# Altium project Cats_and_Dogs_Schematics_ESE516.PrjPcb (part 1 of 3)
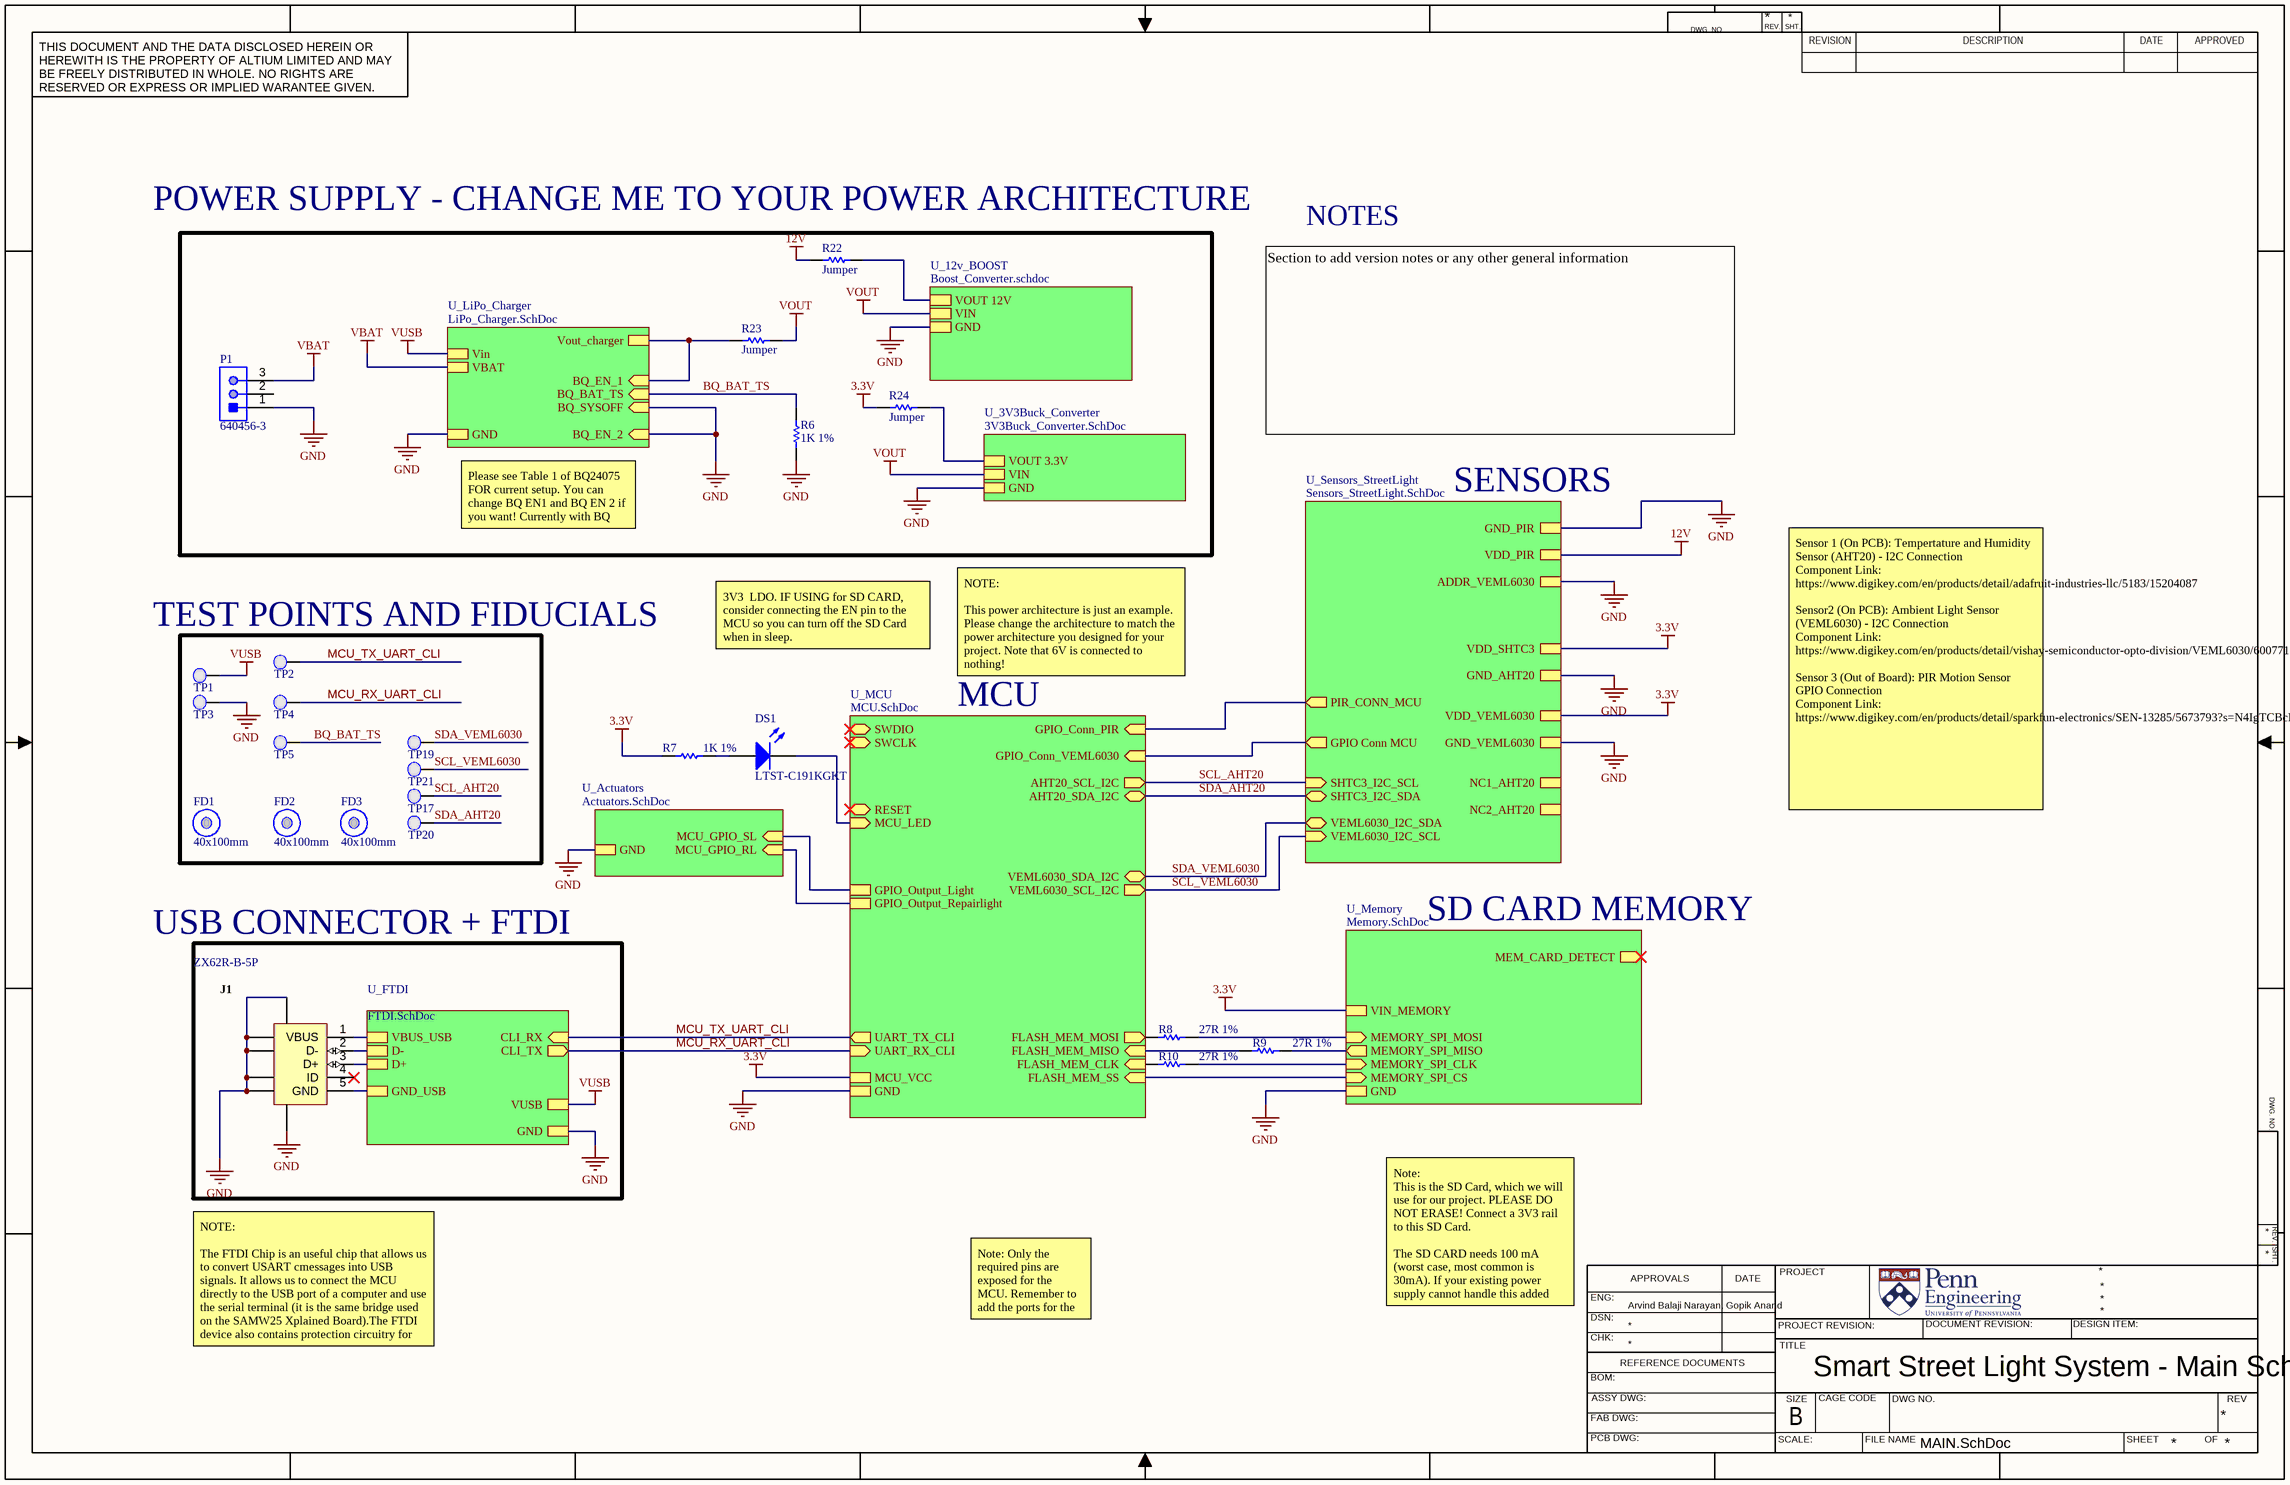
[diagram p0: MAIN.SchDoc]
12 sheets, 135 parts. Net scope: strictly hierarchical (ports join the sheet entries above them; power ports are local).
Board file: Main_PCB.PcbDoc
Sheets:
  MAIN.SchDoc
    U_FTDI = FTDI.SchDoc
    U_Memory = Memory.SchDoc
    U_LiPo_Charger = LiPo_Charger.SchDoc
    U_12v_BOOST = Boost_Converter.schdoc
    U_MCU = MCU.SchDoc
    U_Sensors_StreetLight = Sensors_StreetLight.SchDoc
      U_Ambient_Light = Ambient_Light.SchDoc
      U_PIR_Motion_Sensor = PIR_Motion_Sensor.SchDoc
      U_Temp_and_Humi_SHTC3 = Temp_and_Humi_SHTC3.SchDoc
    U_Actuators = Actuators.SchDoc
    U_3V3Buck_Converter = 3V3Buck_Converter.SchDoc

## Sheet MAIN.SchDoc: Smart Street Light System - Main Schematic Doc
size 431 x 279 mm; Author: Arvind Balaji Narayan, Gopik Anand; CompanyName: Cats_and_Dogs; Engineer: Arvind Balaji Narayan, Gopik Anand; Organization: University of Pennsylvania

### Parts
DS1  LTST-C191KGKT  [LITE-ON-LTST-C191KRKT-2_V]
FD1  40x100mm  [Fiducial_FT]  (no BOM)
FD2  40x100mm  [Fiducial_FT]  (no BOM)
FD3  40x100mm  [Fiducial_FT]  (no BOM)
J1  ZX62R-B-5P  [HIRO-ZX62R-B-5P_V]
P1  640456-3  [TECO-640456-3]
R6  1K 1%  [RESC0603(1608)_N]
R7  1K 1%  [RESC0603(1608)_N]
R8  27R 1%  [RESC0603(1608)_N]
R9  27R 1%  [RESC0603(1608)_N]
R10  27R 1%  [RESC0603(1608)_N]
R22  Jumper  [RESC0603(1608)_N]
R23  Jumper  [RESC0805(2012)_N]
R24  Jumper  [RESC0603(1608)_N]
TP1  0.1" Pad  [PCBComponent]  (value not drawn)  (no BOM)
TP2  0.1" Pad  [PCBComponent]  (value not drawn)  (no BOM)
TP3  0.1" Pad  [PCBComponent]  (value not drawn)  (no BOM)
TP4  0.1" Pad  [PCBComponent]  (value not drawn)  (no BOM)
TP5  0.1" Pad  [PCBComponent]  (value not drawn)  (no BOM)
TP17  0.1" Pad  [PCBComponent]  (value not drawn)  (no BOM)
TP19  0.1" Pad  [PCBComponent]  (value not drawn)  (no BOM)
TP20  0.1" Pad  [PCBComponent]  (value not drawn)  (no BOM)
TP21  0.1" Pad  [PCBComponent]  (value not drawn)  (no BOM)

### Sub-sheets
U_3V3Buck_Converter = 3V3Buck_Converter.SchDoc: VIN, GND, VOUT 3.3V
U_12v_BOOST = Boost_Converter.schdoc: VOUT 12V, VIN, GND
U_Actuators = Actuators.SchDoc: MCU_GPIO_SL (in), MCU_GPIO_RL (in), GND
U_FTDI = FTDI.SchDoc: CLI_RX (in), CLI_TX (out), VUSB, GND, VBUS_USB, D-, D+, GND_USB
U_LiPo_Charger = LiPo_Charger.SchDoc: BQ_EN_2 (in), BQ_SYSOFF (in), BQ_EN_1 (in), BQ_BAT_TS (in), Vin, GND, VBAT, Vout_charger
U_MCU = MCU.SchDoc: SWDIO (bidir), SWCLK (in), UART_TX_CLI (out), UART_RX_CLI (in), FLASH_MEM_SS (in), FLASH_MEM_CLK (in), FLASH_MEM_MISO (in), FLASH_MEM_MOSI (out), RESET (bidir), MCU_LED (in), MCU_VCC, GND, VEML6030_SDA_I2C (bidir), VEML6030_SCL_I2C (out), AHT20_SDA_I2C (bidir), AHT20_SCL_I2C (out), GPIO_Output_Light, GPIO_Output_Repairlight, GPIO_Conn_VEML6030 (in), GPIO_Conn_PIR (in)
U_Memory = Memory.SchDoc: MEMORY_SPI_MOSI (in), MEMORY_SPI_MISO (out), MEMORY_SPI_CLK (in), MEMORY_SPI_CS (in), MEM_CARD_DETECT (out), VIN_MEMORY, GND
U_Sensors_StreetLight = Sensors_StreetLight.SchDoc: ADDR_VEML6030, GPIO Conn MCU (out), GND_AHT20, VDD_SHTC3, VEML6030_I2C_SCL (in), VEML6030_I2C_SDA (bidir), VDD_VEML6030, GND_VEML6030, SHTC3_I2C_SCL (in), NC1_AHT20, SHTC3_I2C_SDA (bidir), NC2_AHT20, PIR_CONN_MCU (out), VDD_PIR, GND_PIR

### Nets
3.3V: R7.1 R24.2 ; sheet U_Memory/VIN_MEMORY, sheet U_MCU/MCU_VCC, sheet U_Sensors_StreetLight/VDD_SHTC3, sheet U_Sensors_StreetLight/VDD_VEML6030
12V: R22.2 ; sheet U_Sensors_StreetLight/VDD_PIR
12V out: R22.1 ; sheet U_12v_BOOST/VOUT 12V
GND: J1.5(GND) J1.6(SHLD) J1.7(SHLD) J1.8(SHLD) J1.9(SHLD) J1.10(SHLD) J1.11(SHLD) P1.1 R6.2 TP3.1(PAD) ; sheet U_FTDI/GND, sheet U_FTDI/GND_USB, sheet U_Memory/GND, sheet U_LiPo_Charger/BQ_EN_2, sheet U_LiPo_Charger/BQ_SYSOFF, sheet U_LiPo_Charger/GND, sheet U_12v_BOOST/GND, sheet U_MCU/GND, sheet U_Sensors_StreetLight/ADDR_VEML6030, sheet U_Sensors_StreetLight/GND_AHT20, sheet U_Sensors_StreetLight/GND_VEML6030, sheet U_Sensors_StreetLight/GND_PIR, sheet U_Actuators/GND, sheet U_3V3Buck_Converter/GND
VBAT: P1.3 ; sheet U_LiPo_Charger/VBAT
VBUS: J1.1(VBUS) ; sheet U_FTDI/VBUS_USB
VOUT: R23.2 ; sheet U_12v_BOOST/VIN, sheet U_3V3Buck_Converter/VIN
VUSB: TP1.1(PAD) ; sheet U_FTDI/VUSB, sheet U_LiPo_Charger/Vin
BQ_BAT_TS: R6.1 TP5.1(PAD) ; sheet U_LiPo_Charger/BQ_BAT_TS
BQ_EN_1: R23.1 ; sheet U_LiPo_Charger/BQ_EN_1, sheet U_LiPo_Charger/Vout_charger
FLASH_MEM_SPI_SS: sheet U_Memory/MEMORY_SPI_CS, sheet U_MCU/FLASH_MEM_SS
GPIO_Conn_MCU: sheet U_MCU/GPIO_Conn_VEML6030, sheet U_Sensors_StreetLight/GPIO Conn MCU
GPIO_Conn_PIR: sheet U_MCU/GPIO_Conn_PIR, sheet U_Sensors_StreetLight/PIR_CONN_MCU
GPIO_o/p_Green: sheet U_MCU/GPIO_Output_Light, sheet U_Actuators/MCU_GPIO_SL
GPIO_o/p_Red: sheet U_MCU/GPIO_Output_Repairlight, sheet U_Actuators/MCU_GPIO_RL
MCU_LED: DS1.2(K) ; sheet U_MCU/MCU_LED
MCU_RX_UART_CLI: TP4.1(PAD) ; sheet U_FTDI/CLI_TX, sheet U_MCU/UART_RX_CLI
MCU_TX_UART_CLI: TP2.1(PAD) ; sheet U_FTDI/CLI_RX, sheet U_MCU/UART_TX_CLI
MEM_SPI_CLK: R10.2 ; sheet U_Memory/MEMORY_SPI_CLK
MEM_SPI_MISO: R9.2 ; sheet U_Memory/MEMORY_SPI_MISO
MEM_SPI_MOSI: R8.2 ; sheet U_Memory/MEMORY_SPI_MOSI
SCL_AHT20: TP17.1(PAD) ; sheet U_MCU/AHT20_SCL_I2C, sheet U_Sensors_StreetLight/SHTC3_I2C_SCL
SCL_VEML6030: TP21.1(PAD) ; sheet U_MCU/VEML6030_SCL_I2C, sheet U_Sensors_StreetLight/VEML6030_I2C_SCL
SDA_AHT20: TP20.1(PAD) ; sheet U_MCU/AHT20_SDA_I2C, sheet U_Sensors_StreetLight/SHTC3_I2C_SDA
SDA_VEML6030: TP19.1(PAD) ; sheet U_MCU/VEML6030_SDA_I2C, sheet U_Sensors_StreetLight/VEML6030_I2C_SDA
SERCOM1_PAD2_SPI_MISO: R9.1 ; sheet U_MCU/FLASH_MEM_MISO
SERCOM1_PAD2_SPI_MOSI: R8.1 ; sheet U_MCU/FLASH_MEM_MOSI
SERCOM1_PAD3_SPI_SCK: R10.1 ; sheet U_MCU/FLASH_MEM_CLK
USB_DATA_N: J1.2(D-) ; sheet U_FTDI/D-
USB_DATA_P: J1.3(D+) ; sheet U_FTDI/D+
VCCX: R24.1 ; sheet U_3V3Buck_Converter/VOUT 3.3V
NetDS1_1: DS1.1(A) R7.2

Not connected (* = marked no-connect by the designer): J1 4(ID)*; P1 2

### Notes on the sheet
- (near R22) POWER SUPPLY - CHANGE ME TO YOUR POWER ARCHITECTURE
- NOTES
- Section to add version notes or any other general information
- SENSORS
- Please see Table 1 of BQ24075 FOR current setup. You can change BQ EN1 and BQ EN 2 if you want! Currently with BQ EN 1 = 1 and BQ EN 2 = 2, the current from the USB is limited to 500 mA.
- TEST POINTS AND FIDUCIALS
- 3V3  LDO. IF USING for SD CARD, consider connecting the EN pin to the MCU so you can turn off the SD Card when in sleep.
- NOTE:
  This power architecture is just an example. Please change the architecture to match the power architecture you designed for your project. Note that 6V is connected to nothing!
- MCU
- Sensor 1 (On PCB): Tempertature and Humidity Sensor (AHT20) - I2C Connection
  Component Link: https://www.digikey.com/en/products/detail/adafruit-industries-llc/5183/15204087
  Sensor2 (On PCB): Ambient Light Sensor (VEML6030) - I2C Connection
  Component Link: https://www.digikey.com/en/products/detail/vishay-semiconductor-opto-division/VEML6030/6007711
  Sensor 3 (Out of Board): PIR Motion Sensor GPIO Connection
  Component Link: https://www.digikey.com/en/products/detail/sparkfun-electronics/SEN-13285/5673793?s=N4IgTCBcDaIM4FMB2BGAzGAHAVhAXQF8g(SEN13285)
- USB CONNECTOR + FTDI
- SD CARD MEMORY
- Note:
  This is the SD Card, which we will use for our project. PLEASE DO NOT ERASE! Connect a 3V3 rail to this SD Card.
  The SD CARD needs 100 mA (worst case, most common is 30mA). If your existing power supply cannot handle this added current, please use the 3V3 LDO found in this project to power your SD Card.
- NOTE:
  The FTDI Chip is an useful chip that allows us to convert USART cmessages into USB signals. It allows us to connect the MCU directly to the USB port of a computer and use the serial terminal (it is the same bridge used on the SAMW25 Xplained Board).The FTDI device also contains protection circuitry for the USB.
- Note: Only the required pins are exposed for the MCU. Remember to add the ports for the pins you need to be exposed!
- DWG. NO.
- REV.
- SHT.
- THIS DOCUMENT AND THE DATA DISCLOSED HEREIN OR HEREWITH IS THE PROPERTY OF ALTIUM LIMITED AND MAY BE FREELY DISTRIBUTED IN WHOLE. NO RIGHTS ARE RESERVED OR EXPRESS OR IMPLIED WARANTEE GIVEN.
- REVISION
- DESCRIPTION
- DATE
- APPROVED
- ENG:
- APPROVALS
- PROJECT
- DSN:
- CHK:
- REFERENCE DOCUMENTS
- PROJECT REVISION:
- TITLE
- DOCUMENT REVISION:
- DESIGN ITEM:
- BOM:
- FAB DWG:
- PCB DWG:
- ASSY DWG:
- SCALE:
- SIZE
- B
- CAGE CODE
- FILE NAME
- DWG NO.
- SHEET
- OF
- REV

### Library data of the parts
DS1 = CMP-2000-05198-1: Chip LED, Green, 574 nm, 40 pF, -55 to 85 degC, 2-Pin SMD, RoHS, Tape and Reel; Manufacturer: Lite-On; Rad Hardened: No; Emitting Color: YellowGreen; Product Height (mm): 0.55mm; Forward Voltage: 2.4V; Number of Elements: 1; Dominant Wave Length: 571nm; DELETED: Compliant; Viewing Angle: 130deg; High Brightness: Yes; Peak Wavelength: 574nm; Type: Uni-Color; Forward Current: 30mA; Product Length (mm): 1.6mm; Luminous Intensity: 35mcd; Test Current (It): 20mA; Chip Material: AlGaInP; Product Depth (mm): 0.8mm; Shape Type: Rectangular; Reverse Voltage: 5V; Power Dissipation: 75W; Pin Count: 2; Lens Dimensions: 1.1X0.8X0.37mm; Packaging: TapeandReel; Main Category: ChipLED; Operating Temperature Classification: Industrial; Package Type: ChipLed; Mounting: SurfaceMount; Lum Intensity: 35mcd; Operating Temp Range: -55Cto85C; Datasheet Version: Jan-07; Datasheet URL: http://download.siliconexpert.com/pdfs/2007/08/26/semi_b/manual/lot/ds/ltst-c191kgkt.pdf; Manufacturer URL: http://www.us.liteon.com/
FD1-FD3 = CMP-00174-A.4: Fiducial 40x100mm
J1 = CMP-0031-00001-1: Connector; USBMicro-B,Reverse type, SMT; 5 Position; Right Angle; DatasheetVersion: 08/2010; Operating Temperature: -30 to 85 degC; Mounting Technology: Surface Mount; PartNumber: ZX62R-B-5P; PackageReference: ZX62R-B-5P; ComponentLink2URL: http://www.hirose.co.jp/cataloge_hp/e24200011.pdf; ComponentLink1URL: http://www.hirose.com/â€Ž; ComponentLink2Description: Datasheet; PackageDescription: 5-Pin USB Micro-B R/A Connector; ComponentLink1Description: Manufacturer URL
P1 = CMP-2000-05418-1: Male Header, Pitch 2.54 mm, 1 x 3 Position, Height 10.03 mm, Tail Length 3.56 mm, -55 to 105 degC; Manufacturer: TE Connectivity; Agency Approvals: CSA,UL; Angle: Straight; Number of Positions: 3; Standards: RoHSCompliant,ELVCompliant,UL94V-0; Current, Rating: 5 / A; Connector Type: MTA-100; Mount Angle: Vertical; Material, Housing: Polyester; Temperature, Operating: -55to+105 / degC; Voltage, Rating: 250 / V; Color, Housing: White; Contact Centerline Spacing: 0.100 / in.; Special Features: Pinstrip; Material, Contact: CopperAlloy; Contact Termination Area Plating: Tin; Primary Type: InterconnectSystem; Pin Spacing: 0.1 / "; Brand/Series: MTA-100Series; Mounting Hole Size: 0.04 / "; Manufacturer URL: http://www.te.com/; Datasheet URL: https://datasheet.ciiva.com/16456/eng-ds-82056-mta-0608-16456886.pdf; Flammability Rating: UL94V-0; Mounting Type: PCMount; Contact Mating Area Plating: Tin; Datasheet Version: Jun-08; Number of Rows: 1; Termination: Solder; Type: PCBPlug; Length, Pin: 0.14 / "; Color: White; Contact Plating: Tin; Contact Shape: Square; Number of Contacts: 3; Size, Post: 0.025 / in.; Length, Terminal Post: 0.14 / in.; Length, Overall: 0.3 / "
R6 R7 = CMP-1012-00510-1: 1K 0.1W 1% 0603 (1608 Metric)  SMD; Case-Metric: 1608; Case-EIA: 0603; Value: 1000.00 Ohm; Technology: SMT; Tolerance: 1 %; Power: 0.1 W
R8-R10 = CMP-1012-00331-1: 27R 0.1W 1% 0603 (1608 Metric)  SMD; Case-EIA: 0603; Value: 27.00 Ohm; Case-Metric: 1608; Technology: SMT; Tolerance: 1 %; Power: 0.1 W
R22 R24 = CMP-1012-00001-1: Jumper 0603 (1608 Metric); Case-Metric: 1608; Value: 0.00 Ohm; Power: None; Case-EIA: 0603; Technology: SMT; Tolerance: None
R23 = CMP-1013-00001-1: Jumper 0805 (2012 Metric); Case-EIA: 0805; Value: 0.00 Ohm; Tolerance: None; Case-Metric: 2012; Technology: SMT; Power: None
TP1-TP5 TP17 TP19-TP21 = 0.1" Pad-A.4

## Sheet FTDI.SchDoc: Smart Street Light System - FTDI Schematic Doc
size 431 x 279 mm; Author: Arvind Balaji Narayan, Gopik Anand; CompanyName: Cats_and_Dogs; Engineer: Arvind Balaji Narayan, Gopik Anand; Organization: University of Pennsylvania
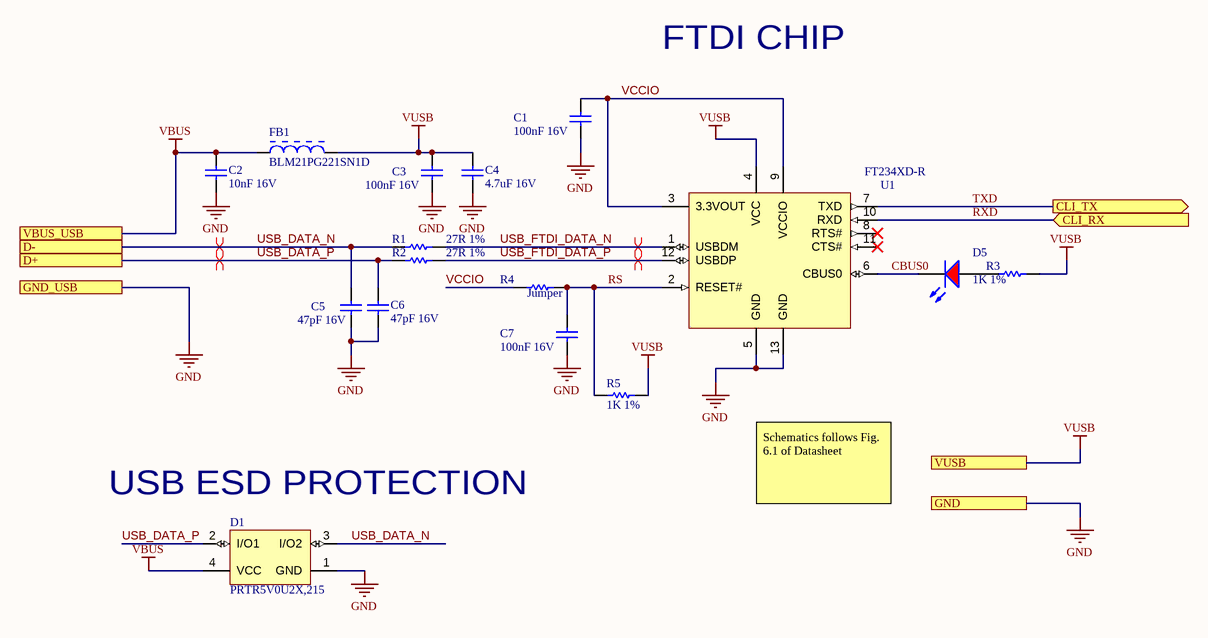
[diagram p1: FTDI.SchDoc]

### Parts
C1  100nF 16V  [CAPC0603(1608)100_N]
C2  10nF 16V  [CAPC0603(1608)100_N]
C3  100nF 16V  [CAPC0603(1608)100_N]
C4  4.7uF 16V  [CAPC0805(2012)145_N]
C5  47pF 16V  [CAPC0603(1608)100_N]
C6  47pF 16V  [CAPC0603(1608)100_N]
C7  100nF 16V  [CAPC0603(1608)100_N]
D1  PRTR5V0U2X,215  [NXP-SOT143B-4_V]
D5  LTST-C170CKT  [LTST-C170CKT_V]  (value not drawn)
FB1  BLM21PG221SN1D  [MURA-BLM21-B20-CHIP-2_V2]
R1  27R 1%  [RESC0603(1608)_N]
R2  27R 1%  [RESC0603(1608)_N]
R3  1K 1%  [RESC0603(1608)_N]
R4  Jumper  [RESC0603(1608)_N]
R5  1K 1%  [RESC0603(1608)_N]
U1  FT234XD-R  [DFN-12_V]

### Ports
CLI_RX (in), CLI_TX (out), D+, D-, GND, GND_USB, VBUS_USB, VUSB

### Nets
GND: C1.1 C2.1 C3.1 C4.1 C5.1 C6.1 C7.1 D1.1(GND) U1.5(GND) U1.13(GND) ; port GND, port GND_USB
VBUS: C2.2 D1.4(VCC) FB1.1 ; port VBUS_USB
VUSB: C3.2 C4.2 FB1.2 R3.2 R5.1 U1.4(VCC) ; port VUSB
CBUS0: D5.2(K) U1.6(CBUS0)
RS: C7.2 R4.2 R5.2 U1.2(RESET#)
RXD: U1.10(RXD) ; port CLI_RX  [project net MCU_TX_UART_CLI]
TXD: U1.7(TXD) ; port CLI_TX  [project net MCU_RX_UART_CLI]
USB_DATA_N: C5.2 D1.3(I/O2) R1.1 ; port D-
USB_DATA_P: C6.2 D1.2(I/O1) R2.1 ; port D+
USB_FTDI_DATA_N: R1.2 U1.1(USBDM)
USB_FTDI_DATA_P: R2.2 U1.12(USBDP)
VCCIO: C1.2 R4.1 U1.3(3.3VOUT) U1.9(VCCIO)
NetD5_1: D5.1(A) R3.1

Not connected (* = marked no-connect by the designer): U1 8(RTS#)* 11(CTS#)*

### Layout directives
differential pair: USB_DATA_N, USB_DATA_P, USB_FTDI_DATA_N, USB_FTDI_DATA_P

### Notes on the sheet
- FTDI CHIP
- (near D1) USB ESD PROTECTION
- Schematics follows Fig. 6.1 of Datasheet
- DWG. NO.
- REV.
- SHT.
- THIS DOCUMENT AND THE DATA DISCLOSED HEREIN OR HEREWITH IS THE PROPERTY OF ALTIUM LIMITED AND MAY BE FREELY DISTRIBUTED IN WHOLE. NO RIGHTS ARE RESERVED OR EXPRESS OR IMPLIED WARANTEE GIVEN.
- REVISION
- DESCRIPTION
- DATE
- APPROVED
- ENG:
- APPROVALS
- PROJECT
- DSN:
- CHK:
- REFERENCE DOCUMENTS
- PROJECT REVISION:
- TITLE
- DOCUMENT REVISION:
- DESIGN ITEM:
- BOM:
- FAB DWG:
- PCB DWG:
- ASSY DWG:
- SCALE:
- SIZE
- B
- CAGE CODE
- FILE NAME
- DWG NO.
- SHEET
- OF
- REV

### Library data of the parts
C1 C3 C7 = CMP-1035-02584-1: CAP 100nF 16V ±10% 0603 (1608 Metric) Thickness 1mm SMD; Tolerance: Â±10%; Case-EIA: 0603; Case-Metric: 1608; Technology: SMT; Max Thickness: 1 mm; Value: 100nF; Rated Voltage: 16 V
C2 = CMP-1035-02311-1: CAP 10nF 16V ±10% 0603 (1608 Metric) Thickness 1mm SMD; Case-EIA: 0603; Case-Metric: 1608; Tolerance: Â±10%; Rated Voltage: 16 V; Value: 10nF; Max Thickness: 1 mm; Technology: SMT
C4 = CMP-1036-04893-1: CAP 4.7uF 16V -20% to +80% 0805 (2012 Metric) Thickness 1.45mm SMD; Case-Metric: 2012; Case-EIA: 0805; Max Thickness: 1.45 mm; Value: 4.7uF; Rated Voltage: 16 V; Tolerance: -20% to +80%; Technology: SMT
C5 C6 = CMP-1035-01048-1: CAP 47pF 16V ±0.5pF 0603 (1608 Metric) Thickness 1mm SMD; Case-EIA: 0603; Case-Metric: 1608; Tolerance: Â±0.5pF; Technology: SMT; Value: 47pF; Rated Voltage: 16 V; Max Thickness: 1 mm
D1 = CMP-2000-05285-1: Ultra Low Capacitance Double Rail-to-Rail ESD Protection Diode, 5.5 V, 1 pF, -40 to 85 degC, 4-Pin SOT143B, RoHS, Tape and Reel; Manufacturer: NXP Semiconductors; Capacitance Value: 16pF; Number of Elements: 1; Rad Hardened: No; Reverse Breakdown Voltage: 6V; Working Voltage (Max): 5.5V; Polarity: Uni-Directional; Configuration: Quad; Leakage Current: 0.1uA; Product Height (mm): 1mm; Suppressor Type: DiodeArrays; Product Length (mm): 3mm; Product Depth (mm): 1.4mm; ESD Protection Voltage: 8KV@ContactDisc; Package Type: SOT; Mounting: SurfaceMount; Packaging: TapeandReel; Datasheet Version: Rev. 02, 01/2008; Reverse Stand-off Voltage: 5.5V; Manufacturer URL: http://www.nxp.com/; Operating Temp Range: -40Cto85C; Operating Temperature Classification: Industrial; Working Voltage: 5.5V; Operating Temperature Min Deg. C: -40C; Datasheet URL: https://datasheet.ciiva.com/4479/prtr5v0u2x-102853-4479461.pdf; Leakage Current (Max): 0.1uA; Direction Type: Uni-Directional; Pin Count: 3+Tab; Operating Temperature Max Deg. C: 85C; Mounting Style: SurfaceMount; Package / Case: SOT
D5 = CMP-1674-00001-5: LED Uni-Color Red, 100 mW, 200 mA, -55 to 85 degC, 2-Pin SMD, RoHS, Tape and Reel; Manufacturer: Lite-On; PackageReference: C170CKT; ComponentLink1Description: Manufacturer URL; ComponentLink1URL: http://www.us.liteon.com/; Package Quantity: 3000; Packaging: Tape and Reel; Pins: 2; ComponentLink2URL: http://media.digikey.com/pdf/Data%20Sheets/Lite-On%20PDFs/LTST-C170CKT.pdf; Max Operating Temperature: 85 degC; Min Operating Temperature: -55 degC; Mounting Technology: Surface Mount; Mount: Surface Mount; Length: 2 mm; ComponentLink2Description: Datasheet; DatasheetVersion: 03/2003; Height: 1.1 mm; PackageDescription: 2-Pin Surface Mount Device, Body 2 x 1.25 mm; RoHSCompliant: true; Colour: Red
FB1 = CMP-0686-00610-2: Chip Ferrite Bead for Power Lines, 220 Ohm, 2000 mA, -55 to 125 degC, 2 x 1.25 x 1.05 mm SMD, Tape and Reel; Manufacturer: Murata; DC Resistance: 0.045 Ohm Max.; Impedance (at 100 MHz): 220 Ohm +/- 25%; Rated Current: 2000 mA; PartNumber: BLM21PG221SN1D; Mounting Technology: Surface Mount; DatasheetVersion: 08/2013; ComponentLink3URL: http://www.murata.com/products/catalog/pdf/c31e.pdf; ComponentLink1URL: http://www.murata.com/; ComponentLink1Description: Manufacturer URL; ComponentLink2URL: http://www.murata.com/products/catalog/pdf/c31e.pdf; PackageDescription: 2-Pin Chip, Body 2 x 1.25 mm; ComponentLink3Description: Package Specification; Operating Temperature Range: -55 to 125 degC; Packing: Tape and Reel; ComponentLink2Description: Datasheet; PackageReference: BLM21_H1050-2
R1 R2 = CMP-1012-00331-1: as R8 on sheet MAIN; Technology: SMT; Tolerance: 1 %; Power: 0.1 W
R3 R5 = CMP-1012-00510-1: as R6 on sheet MAIN; Technology: SMT; Tolerance: 1 %; Power: 0.1 W
R4 = CMP-1012-00001-1: as R22 on sheet MAIN; Technology: SMT; Tolerance: None
U1 = CMP-0248-00027-1: FT234XD USB to BASIC UART IC, -40 to +85 degC, 12-Pin DFN, Pb-Free, Tape and Reel; Manufacturer: FTDI; PackageReference: DFN-12; PackageVersion: Feb-13; DatasheetVersion: ver 1.1, Feb-2013; ComponentLink1URL: http://www.ftdichip.com/; PartNumber: FT234XD-R; ComponentLink2URL: http://www.ftdichip.com/Support/Documents/DataSheets/ICs/DS_FT234XD.pdf; ComponentLink1Description: Manufacturer URL; PackageDescription: 12-Pin Dual Flat No-Lead, 3 x 3 mm Body, 0.45 mm Pitch, Exposed Pad; ComponentLink2Description: Datasheet

## Sheet Memory.SchDoc: Smart Street Light System - Memory Schematic Doc
size 431 x 279 mm; Author: Arvind Balaji Narayan, Gopik Anand; CompanyName: Cats_and_Dogs; Engineer: Arvind Balaji Narayan, Gopik Anand; Organization: University of Pennsylvania
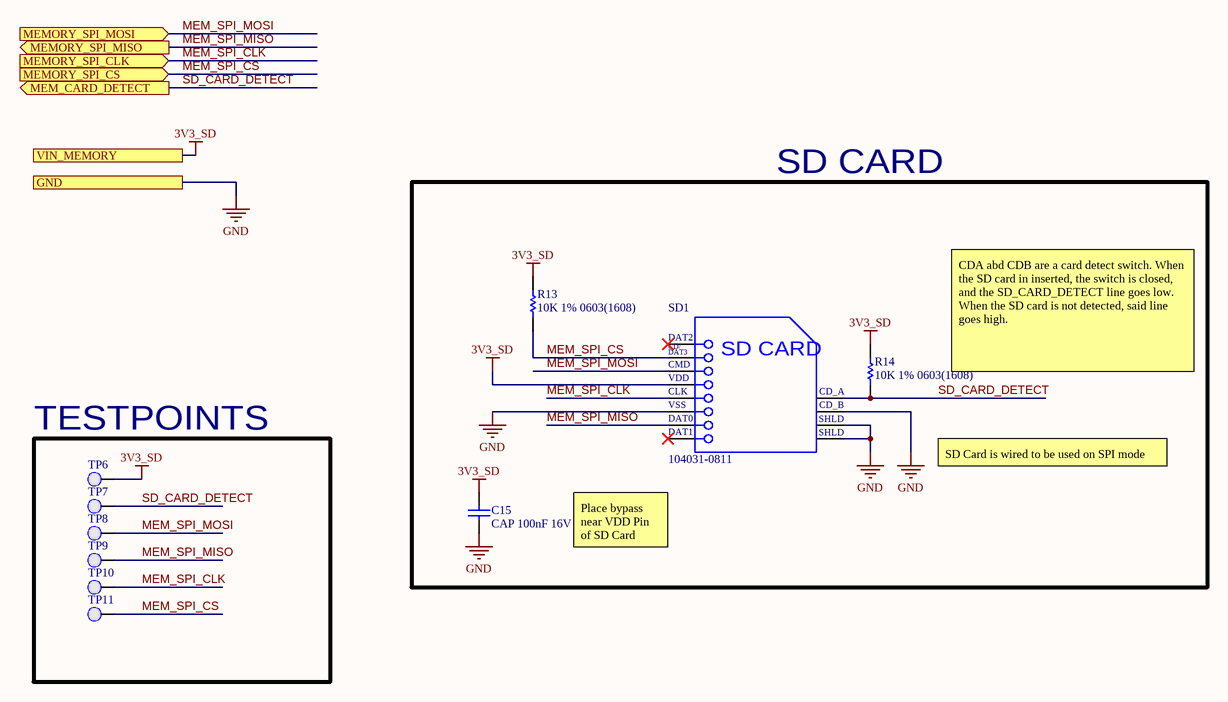
[diagram p2: Memory.SchDoc]

### Parts
C15  CAP 100nF 16V 0603(1608)  [CAPC0603(1608)100_N]
R13  10K 1% 0603(1608)  [RESC0603(1608)_N]
R14  10K 1% 0603(1608)  [RESC0603(1608)_N]
SD1  104031-0811  [MOLX-104031-0811_V]
TP6  0.1" Pad  [PCBComponent]  (value not drawn)  (no BOM)
TP7  0.1" Pad  [PCBComponent]  (value not drawn)  (no BOM)
TP8  0.1" Pad  [PCBComponent]  (value not drawn)  (no BOM)
TP9  0.1" Pad  [PCBComponent]  (value not drawn)  (no BOM)
TP10  0.1" Pad  [PCBComponent]  (value not drawn)  (no BOM)
TP11  0.1" Pad  [PCBComponent]  (value not drawn)  (no BOM)

### Blocks framed on the sheet
SD CARD: C15 R13 R14 SD1
TESTPOINTS: TP6-TP11

### Ports
GND, MEM_CARD_DETECT (out), MEMORY_SPI_CLK (in), MEMORY_SPI_CS (in), MEMORY_SPI_MISO (out), MEMORY_SPI_MOSI (in), VIN_MEMORY

### Nets
3V3_SD: C15.2 R13.2 R14.2 SD1.4(VDD) TP6.1(PAD) ; port VIN_MEMORY  [project net 3.3V]
GND: C15.1 SD1.6(VSS2) SD1.10(CD_B) SD1.11(SHLD1) SD1.12(SHLD2) ; port GND
MEM_SPI_CLK: SD1.5(CLK) TP10.1(PAD) ; port MEMORY_SPI_CLK
MEM_SPI_CS: R13.1 SD1.2(CMD) TP11.1(PAD) ; port MEMORY_SPI_CS  [project net FLASH_MEM_SPI_SS]
MEM_SPI_MISO: SD1.7(DAT0) TP9.1(PAD) ; port MEMORY_SPI_MISO
MEM_SPI_MOSI: SD1.3(VSS1) TP8.1(PAD) ; port MEMORY_SPI_MOSI
SD_CARD_DETECT: R14.1 SD1.9(CD_A) TP7.1(PAD) ; port MEM_CARD_DETECT

Not connected (* = marked no-connect by the designer): SD1 1(CD/DAT3)* 8(DAT1)*

### Notes on the sheet
- CDA abd CDB are a card detect switch. When the SD card in inserted, the switch is closed, and the SD_CARD_DETECT line goes low. When the SD card is not detected, said line goes high.
- SD Card is wired to be used on SPI mode
- Place bypass near VDD Pin of SD Card
- DWG. NO.
- REV.
- SHT.
- THIS DOCUMENT AND THE DATA DISCLOSED HEREIN OR HEREWITH IS THE PROPERTY OF ALTIUM LIMITED AND MAY BE FREELY DISTRIBUTED IN WHOLE. NO RIGHTS ARE RESERVED OR EXPRESS OR IMPLIED WARANTEE GIVEN.
- REVISION
- DESCRIPTION
- DATE
- APPROVED
- ENG:
- APPROVALS
- PROJECT
- DSN:
- CHK:
- REFERENCE DOCUMENTS
- PROJECT REVISION:
- TITLE
- DOCUMENT REVISION:
- DESIGN ITEM:
- BOM:
- FAB DWG:
- PCB DWG:
- ASSY DWG:
- SCALE:
- SIZE
- B
- CAGE CODE
- FILE NAME
- DWG NO.
- SHEET
- OF
- REV
- (in symbol CMP-2000-05825-1) DAT2; CD/; DAT3; SD CARD; VSS; SHLD

### Library data of the parts
C15 = CMP-1035-02584-1: as C1 on sheet FTDI; Technology: SMT; Max Thickness: 1 mm; Value: 100nF; Rated Voltage: 16 V
R13 R14 = CMP-1012-00623-1: 10K 0.1W 1% 0603 (1608 Metric)  SMD; Value: 10000.00 Ohm; Case-EIA: 0603; Case-Metric: 1608; Power: 0.1 W; Tolerance: 1 %; Technology: SMT
SD1 = CMP-2000-05825-1: Micro SD Card, RA, -25 to 85 degC, 8-Pin SMD, RoHS, Tape and Reel; Voltage Rating: 10VAC/DC; Number of Contacts: 8; Insertion - Extraction Style: Push-Pull; Pitch: 1.1mm; Mating Cycles: 10000; Brand: Molex; Current Rating: 500mA; Manufacturer URL: http://www.molex.com/; Card Type: microSD; Mounting Type: Standard; Height: 1.42mm; Mounting Technology: SurfaceMount; Contact Plating: Gold; Product Category: MemoryCardConnectors; Package Description: 8-Pin Surface Mount Device, Body 11.95 x 11.4 mm, Pitch 1.1 mm; Datasheet URL: http://www.molex.com/pdm_docs/sd/1040310811_sd.pdf; Termination Style: SMD; Length: 11.4mm; Housing Material: LiquidCrystalPolymer(LCP); Orientation: RightAngle; RoHS: True; Contact Material: PhosphorBronze; Datasheet Version: Rev. E, 04/2006; Packaging: Reel; Manufacturer: Molex; Series: 104031; Product: CardConnectors; Number of Rows: 1Row; Package Reference: 104031-0811
TP6-TP11 = 0.1" Pad-A.4

## Sheet LiPo_Charger.SchDoc: Smart Street Light System - LiPo Schematic Doc\
size 431 x 279 mm; Author: Arvind Balaji Narayan, Gopik Anand; CompanyName: Cats_and_Dogs; Engineer: Arvind Balaji Narayan, Gopik Anand; Organization: University of Pennsylvania
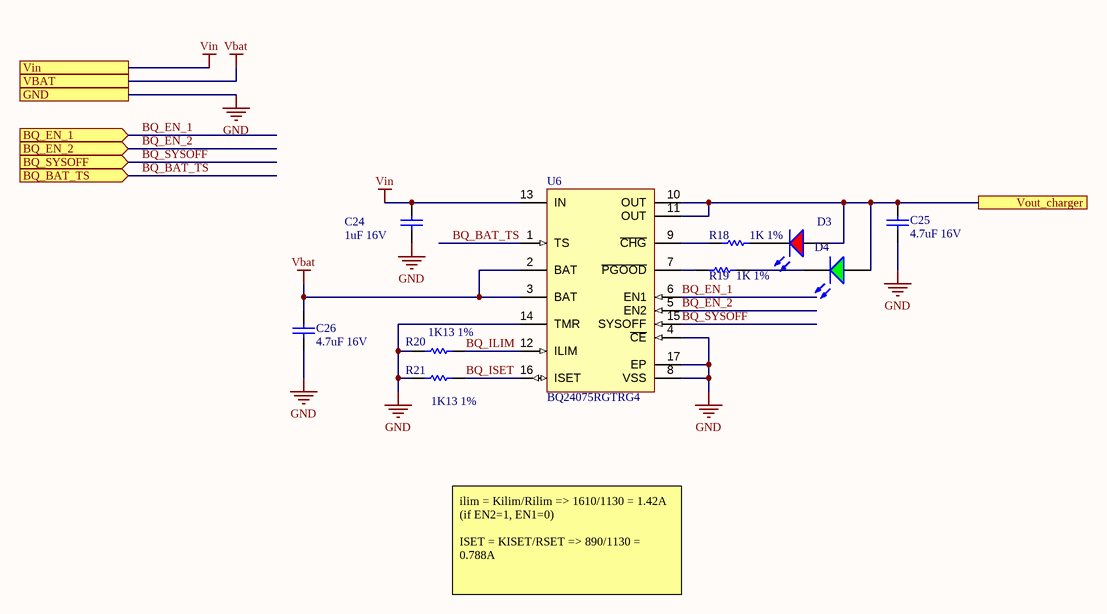
[diagram p3: LiPo_Charger.SchDoc]

### Parts
C24  1uF 16V  [CAPC0603(1608)100_N]
C25  4.7uF 16V  [CAPC0805(2012)145_N]
C26  4.7uF 16V  [CAPC0805(2012)145_N]
D3  LTST-C170CKT  [LTST-C170CKT_V]  (value not drawn)
D4  LTST-C170GKT  [LTST-C170GKT_V]  (value not drawn)
R18  1K 1%  [RESC0603(1608)_N]
R19  1K 1%  [RESC0603(1608)_N]
R20  1K13 1%  [RESC0603(1608)_N]
R21  1K13 1%  [RESC0603(1608)_N]
U6  BQ24075RGTRG4  [RGT16-1700X1700TP]

### Ports
BQ_BAT_TS (in), BQ_EN_1 (in), BQ_EN_2 (in), BQ_SYSOFF (in), GND, VBAT, Vin, Vout_charger

### Nets
GND: C24.1 C25.1 C26.2 R20.1 R21.1 U6.4(~{CE}) U6.5(EN2) U6.8(VSS) U6.14(TMR) U6.15(SYSOFF) U6.17(EP) ; port BQ_EN_2, port BQ_SYSOFF, port GND  [also labelled BQ_EN_2, BQ_SYSOFF]
VBAT: C26.1 U6.2(BAT) U6.3(BAT) ; port VBAT
Vin: C24.2 U6.13(IN) ; port Vin  [project net VUSB]
BQ_BAT_TS: U6.1(TS) ; port BQ_BAT_TS
BQ_EN_1: C25.2 D3.1(A) D4.1(A) U6.6(EN1) U6.10(OUT) U6.11(OUT) ; port BQ_EN_1, port Vout_charger
BQ_ILIM: R20.2 U6.12(ILIM)
BQ_ISET: R21.2 U6.16(ISET)
NetD3_2: D3.2(K) R18.2
NetD4_2: D4.2(K) R19.2
NetR18_1: R18.1 U6.9(~{CHG})
NetR19_1: R19.1 U6.7(~{PGOOD})

### Notes on the sheet
- ilim = Kilim/Rilim => 1610/1130 = 1.42A (if EN2=1, EN1=0)
  ISET = KISET/RSET => 890/1130 = 0.788A
- DWG. NO.
- REV.
- SHT.
- THIS DOCUMENT AND THE DATA DISCLOSED HEREIN OR HEREWITH IS THE PROPERTY OF ALTIUM LIMITED AND MAY BE FREELY DISTRIBUTED IN WHOLE. NO RIGHTS ARE RESERVED OR EXPRESS OR IMPLIED WARANTEE GIVEN.
- REVISION
- DESCRIPTION
- DATE
- APPROVED
- ENG:
- APPROVALS
- PROJECT
- DSN:
- CHK:
- REFERENCE DOCUMENTS
- PROJECT REVISION:
- TITLE
- DOCUMENT REVISION:
- DESIGN ITEM:
- BOM:
- FAB DWG:
- PCB DWG:
- ASSY DWG:
- SCALE:
- SIZE
- B
- CAGE CODE
- FILE NAME
- DWG NO.
- SHEET
- OF
- REV

### Library data of the parts
C24 = CMP-1035-02736-1: CAP 1uF 16V ±5% 0603 (1608 Metric) Thickness 1mm SMD; Case-Metric: 1608; Case-EIA: 0603; Tolerance: Â±5%; Technology: SMT; Max Thickness: 1 mm; Rated Voltage: 16 V; Value: 1uF
C25 C26 = CMP-1036-04893-1: as C4 on sheet FTDI; Max Thickness: 1.45 mm; Value: 4.7uF; Rated Voltage: 16 V; Tolerance: -20% to +80%; Technology: SMT
D3 = CMP-1674-00001-5: as D5 on sheet FTDI; PackageReference: C170CKT; ComponentLink1Description: Manufacturer URL; ComponentLink1URL: http://www.us.liteon.com/; Package Quantity: 3000; Packaging: Tape and Reel; Pins: 2; ComponentLink2URL: http://media.digikey.com/pdf/Data%20Sheets/Lite-On%20PDFs/LTST-C170CKT.pdf; Max Operating Temperature: 85 degC; Min Operating Temperature: -55 degC; Mounting Technology: Surface Mount; Mount: Surface Mount; Length: 2 mm; ComponentLink2Description: Datasheet; DatasheetVersion: 03/2003; Height: 1.1 mm; PackageDescription: 2-Pin Surface Mount Device, Body 2 x 1.25 mm; RoHSCompliant: true; Colour: Red
D4 = CMP-1674-00002-5: LED Uni-Color Green, 100 mW, 120 mA, -55 to 85 degC, 2-Pin SMD, RoHS, Tape and Reel; Manufacturer: Lite-On; PackageReference: C170GKT; ComponentLink1Description: Manufacturer URL; ComponentLink1URL: http://www.us.liteon.com/; Height: 1.1 mm; PackageDescription: 2-Pin Surface Mount Device, Body 2 x 1.25 mm; RoHSCompliant: true; Package Quantity: 1; Packaging: Tape and Reel; Mount: Surface Mount; Min Operating Temperature: -55 degC; DatasheetVersion: 03/2003; Max Operating Temperature: 85 degC; Pins: 2; Mounting Technology: Surface Mount; Length: 2 mm; Colour: Green; ComponentLink2URL: http://media.digikey.com/pdf/Data%20Sheets/Lite-On%20PDFs/LTST-C170GKT.pdf; ComponentLink2Description: Datasheet
R18 R19 = CMP-1012-00510-1: as R6 on sheet MAIN; Technology: SMT; Tolerance: 1 %; Power: 0.1 W
R20 R21 = CMP-1012-00515-1: 1K13 0.1W 1% 0603 (1608 Metric)  SMD; Value: 1130.00 Ohm; Case-EIA: 0603; Case-Metric: 1608; Power: 0.1 W; Tolerance: 1 %; Technology: SMT
U6 = CMP-0321-00237-1: USB-Friendly Li-Ion Battery Charger and Power-Path Management IC, Vout 5.5 V, 4.3 V, -40 to 85 degC, 16-pin QFN (RGT), Green (RoHS & no Sb/Br); Manufacturer: Texas Instruments; Li-Ion: N; SubFamily: Battery Charge Management; Vin(Min)(V): 4.3; ComponentLink1URL: http://www.ti.com/general/docs/lit/getliterature.tsp?genericPartNumber=BQ24075&fileType=pdf; Over Voltage Protection: N; PackageDescription: 16-Pin Plastic Quad Flat No-Lead, 3 x 3 mm Body, 0.5 mm Pitch, 1.7 x 1.7 mm Exposed Pad; NiMH: N; Li-Polymer: N; Eco-Plan: Green (RoHS & no Sb/Br); Code_JEDEC: MO-220; Lead Acid: N; PartNumber: BQ24075RGTRG4; ComponentLink1Description: Datasheet; Mounting Technology: Surface Mount; PackageVersion: revH, Oct-2011; PackageReference: RGT16-1700X1700TP; NiCd: N; DatasheetVersion: SLUS810G

## Sheet Boost_Converter.schdoc: Smart Street Light System - Boost Schematic Doc
size 431 x 279 mm; Author: Arvind Balaji Narayan, Gopik Anand; CompanyName: Cats_and_Dogs; Engineer: Arvind Balaji Narayan, Gopik Anand; Organization: University of Pennsylvania; SheetNumber: 2; SheetTotal: 3
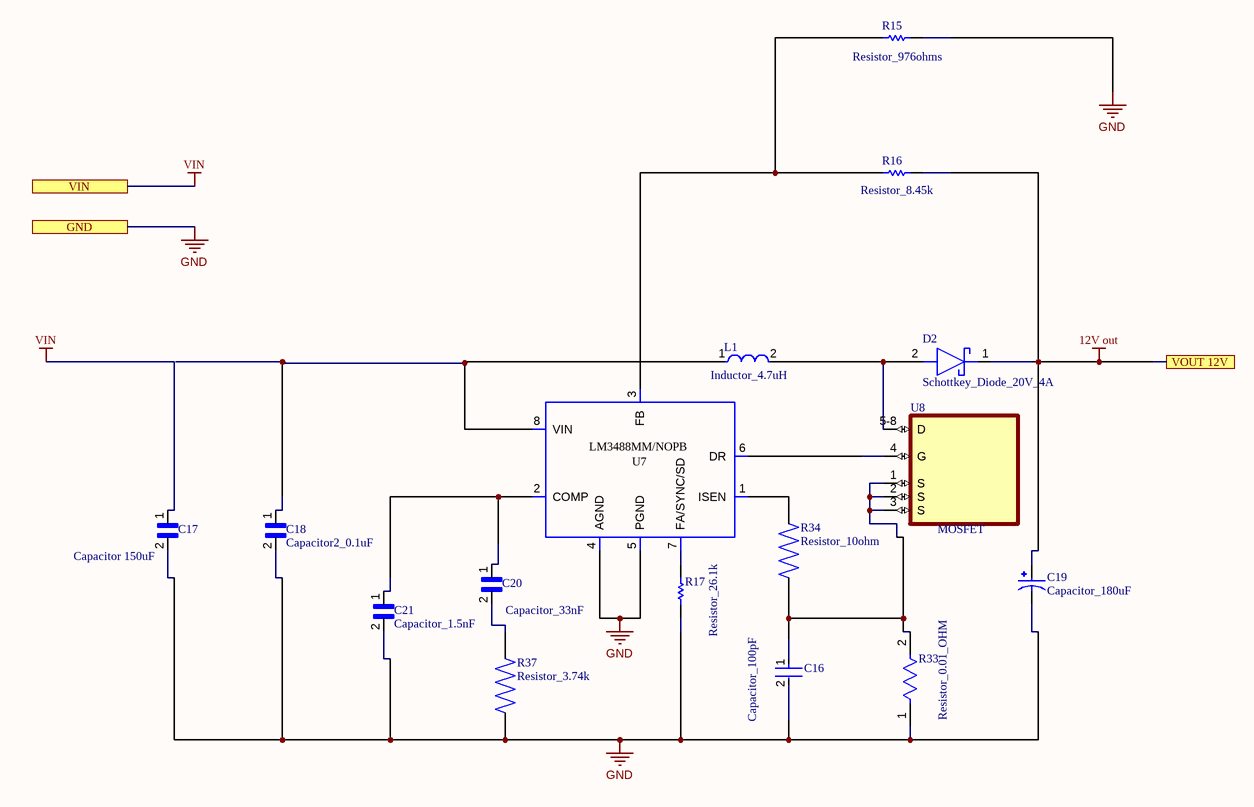
[diagram p4: Boost_Converter.schdoc]

### Parts
C16  Capacitor_100pF  [FP-CC0805-0_1-0_7-IPC_A]
C17  Capacitor 150uF  [Capacitor_150uF]
C18  Capacitor2_0.1uF  [Capacitor2_0.1uF]
C19  Capacitor_180uF  [Capacitor_180uF]
C20  Capacitor_33nF  [Capacitor_33nF]
C21  Capacitor_1.5nF  [Capacitor_1.5nF]
D2  Schottkey_Diode_20V_4A  [Schottkey Diode_20V_4A]
L1  Inductor_4.7uH  [FP-IHLP-2525EZ-FP_2_413x3-MFG]
R15  Resistor_976ohms  [RESC1609X50X30LL10T20]
R16  Resistor_8.45k  [RESC1005X40X25LL05T05]
R17  Resistor_26.1k  [RESC1005X40X25LL05T05]
R33  Resistor_0.01_OHM  [FP-CSR1206-MFG]
R34  Resistor_10ohm  [Resistor_10ohm]
R37  Resistor_3.74k  [Resistor_3.74k]
U7  LM3488MM/NOPB  [Boost_Converter_Footprint]
U8  MOSFET  [MOSFET]

### Ports
GND, VIN, VOUT 12V

### Nets
12V out: C19.1 D2.1(K) R16.2 ; port VOUT 12V
GND: C16.2 C17.2 C18.2 C19.2 C21.2 R15.2 R17.1 R33.1 R37.1 U7.4(AGND) U7.5(PGND) ; port GND
VIN: C17.1 ; port VIN  [project net VOUT]
NetC16_1: C16.1 R33.2 R34.1 U8.1(S) U8.2(S) U8.3(S)
NetC18_1: C18.1 L1.1 U7.8(VIN)
NetC20_1: C20.1 C21.1 U7.2(COMP)
NetC20_2: C20.2 R37.2
NetD2_2: D2.2(A) L1.2 U8.5-8(D)
NetR15_1: R15.1 R16.1 U7.3(FB)
NetR17_2: R17.2 U7.7(FA/SYNC/SD)
NetR34_2: R34.2 U7.1(ISEN)
NetU7_6: U7.6(DR) U8.4(G)

### Notes on the sheet
- DWG. NO.
- REV.
- SHT.
- THIS DOCUMENT AND THE DATA DISCLOSED HEREIN OR HEREWITH IS THE PROPERTY OF ALTIUM LIMITED AND MAY BE FREELY DISTRIBUTED IN WHOLE. NO RIGHTS ARE RESERVED OR EXPRESS OR IMPLIED WARANTEE GIVEN.
- REVISION
- DESCRIPTION
- DATE
- APPROVED
- ENG:
- APPROVALS
- PROJECT
- DSN:
- CHK:
- REFERENCE DOCUMENTS
- PROJECT REVISION:
- TITLE
- DOCUMENT REVISION:
- DESIGN ITEM:
- BOM:
- FAB DWG:
- PCB DWG:
- ASSY DWG:
- SCALE:
- SIZE
- B
- CAGE CODE
- FILE NAME
- DWG NO.
- SHEET
- OF
- REV

### Library data of the parts
C16 = CMP-03422-001508-1: CAP CER 100PF 50V C0G/NPO 0805; Insulation Resistance: 100GR; Dielectric: C0G; Temperature Coefficient: 30ppm/°C; Dielectric Material: Ceramic; Tolerance: 5%; REACH SVHC: No SVHC; Packaging: Tape and Reel; Max Operating Temperature: 125°C; Case Code (Imperial): 0805; Number of Pins: 2; Height: 0.6mm; Case/Package: 0805; Resistor Type: Ceramic; Length: 2mm; Width: 1.25mm; RoHS Compliant: Yes; Thickness: 0.024inch; Case Code (Metric): 2012; Radiation Hardening: No; Series: CC; Package Quantity: 1; Voltage: 50V; Voltage Rating (DC): 50V; Capacitance: 100pF; Mount: Surface Mount; Voltage Rating: 50V; Min Operating Temperature: -55°C; Lead Free: Lead Free; Termination: SMD/SMT; Depth: 1.25mm
C17 = Capacitor 150uF: Multilayer Ceramic Capacitor 150uF 4V 20% 1210 Emboss T/R; Manufacturer: Taiyo Yuden; Manufacturer Part Number: AMK325ABJ157MM-P; Supplier 1: Digi-Key; Supplier Part Number 1: 587-AMK325ABJ157MM-PCT-ND; RoHS: Yes; Category: Ceramic Capacitors; Stock 1: 2200; Pricing 1: 1=3.41000, 10=2.75600, 50=2.40540, 100=2.10470, 500=1.60356 (USD); RoHS Compliant: Yes
C18 = Capacitor2_0.1uF: Cap Ceramic 0.1uF 16V X5R 10% SMD 0402 85°C Paper T/R; Manufacturer: KEMET; Manufacturer Part Number: C0402C104K4PACTU; Capacitance: 100nF; Dissipation Factor: 5%; Supplier 1: Digi-Key; Supplier Part Number 1: 399-C0402C104K4PAC7867TR-ND; RoHS: Yes; Category: Ceramic Capacitors; Stock 1: 2168149; Pricing 1: 10000=0.00873, 20000=0.00832 (USD); Mount: Surface Mount; Case/Package: 0402; Case Code (Metric): 1005; Case Code (Imperial): 0402; Contact Plating: Tin,Matte; Dielectric Material: Ceramic; Min Operating Temperature: -55°C; Max Operating Temperature: 85°C; Tolerance: 10%; Packaging: Tape and Reel; Voltage Rating: 16V; Package Quantity: 1; Voltage Rating (DC): 16V; Dielectric: X5R; Termination: SMD/SMT; Series: C; Construction: Flat; Length: 1mm; Width: 0.02inch; Height: 0.5mm; Thickness: 0.022inch; Depth: 0.5mm; Radiation Hardening: No; REACH SVHC: No SVHC; Lead Free: Lead Free; RoHS Compliant: Yes; ComponentLink1URL: https://datasheet.ciiva.com/26938/getdatasheetpartid-161478-26938210.pdf?src-supplier=Verical; ComponentLink1Description: https://datasheet.ciiva.com/26938/getdatasheetpartid-161478-26938210.pdf?src-supplier=Verical
C19 = Capacitor_180uF: Cap Aluminum Polymer 180uF 20VDC 20%( 8 X 6.9mm) SMD 0.025 Ohm 3200mA 5000h 105C T/R; Manufacturer: Panasonic; Manufacturer Part Number: 20SVPF180M; Ripple Current: 3.2A; Voltage Rating: 20V; ESR (Equivalent Series Resistance): 25mR; Polarity: Polar; Leakage Current: 720uA; Life (Hours): 5000Hour; Dissipation Factor: 12%; Supplier 1: Digi-Key; Supplier Part Number 1: P16499CT-ND; RoHS: Yes; Category: Aluminum Electrolytic Capacitors; Pricing 1: 1=1.64000, 10=1.29500, 50=1.12220, 100=0.97120, 500=0.73376 (USD); Mount: Surface Mount; Case/Package: Radial; Number of Pins: 7; Min Operating Temperature: -55°C; Max Operating Temperature: 105°C; Capacitance: 180uF; Tolerance: 20%; Ripple Current (AC): 3.2A; Packaging: Tape and Reel; Voltage Rating (DC): 20V; Package Quantity: 1000; Termination: SMD/SMT; Voltage: 20V; Diameter: 8mm; Length: 6.9mm; Height: 6.9mm; Height - Seated (Max): 0.276inch; REACH SVHC: No SVHC; Lead Free: Lead Free; RoHS Compliant: Yes; ComponentLink1URL: https://datasheet.ciiva.com/24071/svpf-os-262415-24071279.pdf?src-supplier=Mouser; ComponentLink1Description: https://datasheet.ciiva.com/24071/svpf-os-262415-24071279.pdf?src-supplier=Mouser; ComponentLink2URL: https://datasheet.ciiva.com/22746/1734360-22746207.pdf?src-supplier=Element14; ComponentLink2Description: https://datasheet.ciiva.com/22746/1734360-22746207.pdf?src-supplier=Element14; ComponentLink3URL: https://datasheet.ciiva.com/24416/svpf-series-datasheet-24416538.pdf?src-supplier=Onlinecomponents.com; ComponentLink3Description: https://datasheet.ciiva.com/24416/svpf-series-datasheet-24416538.pdf?src-supplier=Onlinecomponents.com
C20 = Capacitor_33nF: TDK - CGA4J2C0G1H333J125AA. - CAP 0.033UF 50V C0G +/-5% SMD 0805; Capacitance: 33nF; Tolerance: 5%; Supplier 1: Digi-Key; Supplier Part Number 1: 445-6950-1-ND; Manufacturer: TDK; Manufacturer Part Number: CGA4J2C0G1H333J125AA; RoHS: Yes; Category: Ceramic Capacitors; Stock 1: 171034; Pricing 1: 1=0.36000, 10=0.24800, 50=0.17320, 100=0.14850, 500=0.11138, 1000=0.09405 (USD); Mount: Surface Mount; Case/Package: 0805; Case Code (Metric): 2012; Case Code (Imperial): 0805; Weight: 0.000194oz; Min Operating Temperature: -55°C; Max Operating Temperature: 125°C; Voltage Rating: 50V; Packaging: Tape and Reel; Voltage Rating (DC): 50V; Dielectric: C0G; Termination: SMD/SMT; Series: CGA; Package Quantity: 1; Resistor Type: Ceramic; Length: 2mm; Width: 0.049inch; Height: 1.25mm; Thickness: 0.057inch; Depth: 1.25mm; Ratings: AEC-Q200; Lead Free: Lead Free; REACH SVHC: No SVHC; RoHS Compliant: Yes; ComponentLink1URL: https://datasheet.ciiva.com/24217/cga4j2c0g1h333j125aa-265991-24217624.pdf?src-supplier=Mouser; ComponentLink1Description: https://datasheet.ciiva.com/24217/cga4j2c0g1h333j125aa-265991-24217624.pdf?src-supplier=Mouser; ComponentLink2URL: https://datasheet.ciiva.com/22704/1807242-22704638.pdf?src-supplier=Element14; ComponentLink2Description: https://datasheet.ciiva.com/22704/1807242-22704638.pdf?src-supplier=Element14
C21 = Capacitor_1.5nF: 1.5 nF ±5% 50V Ceramic Capacitor C0G, NP0 0805 (2012 Metric); Manufacturer: TDK; Manufacturer Part Number: C2012C0G1H152J060AA; Capacitance: 1.5nF; Temperature Coefficient: 30ppm/°C; Supplier 1: Digi-Key; Supplier Part Number 1: 445-1331-1-ND; RoHS: Yes; Category: Ceramic Capacitors; Stock 1: 47415; Pricing 1: 1=0.19000, 10=0.13300, 50=0.07560, 100=0.06270, 500=0.04396, 1000=0.03639 (USD); Mount: Surface Mount; Case/Package: 0805; Case Code (Metric): 2012; Case Code (Imperial): 0805; Dielectric Material: Ceramic; Weight: 0.000194oz; Min Operating Temperature: -55°C; Max Operating Temperature: 125°C; Tolerance: 5%; Dielectric: C0G; Packaging: Tape and Reel; Voltage Rating: 50V; Voltage Rating (DC): 50V; Package Quantity: 1; Termination: SMD/SMT; Series: C; Construction: Flat; Voltage: 50V; Length: 2mm; Width: 0.049inch; Height: 0.6mm; Depth: 1.25mm; Thickness: 0.028inch; Radiation Hardening: No; REACH SVHC: No SVHC; Lead Free: Lead Free; RoHS Compliant: Yes; ComponentLink1URL: https://datasheet.ciiva.com/24217/c2012c0g1h152j060aa-264944-24217755.pdf?src-supplier=Mouser; ComponentLink1Description: https://datasheet.ciiva.com/24217/c2012c0g1h152j060aa-264944-24217755.pdf?src-supplier=Mouser; ComponentLink2URL: https://datasheet.ciiva.com/11788/0900766b80c1bb00-11788088.pdf?src-supplier=RSComponents; ComponentLink2Description: https://datasheet.ciiva.com/11788/0900766b80c1bb00-11788088.pdf?src-supplier=RSComponents; ComponentLink3URL: https://datasheet.ciiva.com/7151/1744655-7151856.pdf?src-supplier=Newark; ComponentLink3Description: https://datasheet.ciiva.com/7151/1744655-7151856.pdf?src-supplier=Newark; ComponentLink4URL: https://datasheet.ciiva.com/6250/tdkmlcccaprange-6250967.pdf?src-supplier=Digi-Key; ComponentLink4Description: https://datasheet.ciiva.com/6250/tdkmlcccaprange-6250967.pdf?src-supplier=Digi-Key; ComponentLink5URL: https://datasheet.ciiva.com/6250/tdkmlcccaprange-6250959.pdf?src-supplier=Digi-Key; ComponentLink5Description: https://datasheet.ciiva.com/6250/tdkmlcccaprange-6250959.pdf?src-supplier=Digi-Key; ComponentLink6URL: https://datasheet.ciiva.com/49048/1571323-49048791.pdf?src-supplier=Element14; ComponentLink6Description: https://datasheet.ciiva.com/49048/1571323-49048791.pdf?src-supplier=Element14; ComponentLink7URL: https://datasheet.ciiva.com/16498/e412-c-16498790.pdf?src-supplier=Future+Electronics; ComponentLink7Description: https://datasheet.ciiva.com/16498/e412-c-16498790.pdf?src-supplier=Future+Electronics; ComponentLink8URL: https://datasheet.ciiva.com/17487/e412-c-17487399.pdf?src-supplier=Avnet+Europe; ComponentLink8Description: https://datasheet.ciiva.com/17487/e412-c-17487399.pdf?src-supplier=Avnet+Europe
D2 = Schottkey_Diode_20V_4A: SL42 Series 20 V 2 A Surface Mount Schottky Barrier Rectifier - DO-214AB (SMC); Manufacturer: ON Semiconductor; Manufacturer Part Number: MBRS320T3; Max Surge Current: 80A; Average Rectified Current: 4A; Element Configuration: Single; Polarity: Standard; Voltage Rating (DC): 20V; Current Rating: 3A; Max Reverse Leakage Current: 2mA; Forward Voltage: 470mV; Max Reverse Current: 500uA; Peak Non-Repetitive Surge Current: 150A; Supplier 1: Digi-Key; Supplier Part Number 1: MBRS320T3OSCT-ND; RoHS: No; Category: Schottky Diodes; Case/Package: SMC; Number of Pins: 2; Min Operating Temperature: -65°C; Max Operating Temperature: 125°C; Package Quantity: 1; Packaging: Tape and Reel; Output Current: 3A; Max Reverse Voltage (DC): 20V; Max Forward Surge Current (Ifsm): 80A; Series: -; Lead Free: Contains Lead; RoHS Compliant: No; ComponentLink1URL: https://datasheet.ciiva.com/4719/mbrs340t3-d-302035-4719013.pdf?src-supplier=Mouser; ComponentLink1Description: https://datasheet.ciiva.com/4719/mbrs340t3-d-302035-4719013.pdf?src-supplier=Mouser; ComponentLink2URL: https://datasheet.ciiva.com/927/mbrs340t3-d-927080.pdf?src-supplier=Digi-Key; ComponentLink2Description: https://datasheet.ciiva.com/927/mbrs340t3-d-927080.pdf?src-supplier=Digi-Key; Supplier 2: Digi-Key; Supplier Part Number 2: SL42-E3/57TGICT-ND; Stock 2: 402; Pricing 2: 1=1.01000, 10=0.88500, 100=0.67820 (USD); Mount: Surface Mount; Forward Current: 4A; Max Repetitive Reverse Voltage (Vrrm): 20V; Radiation Hardening: No; REACH SVHC: Unknown; ComponentLink3URL: https://datasheet.ciiva.com/4714/88742-103296-4714672.pdf?src-supplier=Mouser; ComponentLink3Description: https://datasheet.ciiva.com/4714/88742-103296-4714672.pdf?src-supplier=Mouser; ComponentLink4URL: https://datasheet.ciiva.com/4246/sl42-4246044.pdf?src-supplier=Arrow+Electronics; ComponentLink4Description: https://datasheet.ciiva.com/4246/sl42-4246044.pdf?src-supplier=Arrow+Electronics; ComponentLink5URL: https://datasheet.ciiva.com/23793/1691224-23793280.pdf?src-supplier=Newark; ComponentLink5Description: https://datasheet.ciiva.com/23793/1691224-23793280.pdf?src-supplier=Newark; ComponentLink6URL: https://datasheet.ciiva.com/16355/sl42-16355184.pdf?src-supplier=Future+Electronics; ComponentLink6Description: https://datasheet.ciiva.com/16355/sl42-16355184.pdf?src-supplier=Future+Electronics; ComponentLink7URL: https://datasheet.ciiva.com/25937/sl42-25937965.pdf?src-supplier=Avnet+Europe; ComponentLink7Description: https://datasheet.ciiva.com/25937/sl42-25937965.pdf?src-supplier=Avnet+Europe
L1 = CMP-02424-000065-1: Commercial Inductors, High Saturation Series 4.7uH 6.5A 30.3mΩ 20%; DC Resistance (DCR): 30.3mR; Saturation Current: 7A; Shielding: Shielded; Core Material: Ferrite; Self Resonant Frequency: 1MHz; Test Frequency: 100kHz; Number of Pins: 2; Case/Package: 2525; Lead Free: Lead Free; Depth: 6.72mm; Height - Seated (Max): 0.197inch; Mount: Surface Mount; Termination: SMD/SMT; Max Operating Temperature: 125°C; Inductance Tolerance: 20%; Military Standard: Not; Height: 5mm; RMS Current (Irms): 6.5A; Current Rating: 6.5A; Radiation Hardening: No; Package Quantity: 500; Packaging: Tape and Reel; Width: 0.255inch; Max DC Current: 6.5A; Length: 6.86mm; Min Operating Temperature: -55°C; Tolerance: 20%; Inductance: 4.7uH
R15 = CMP-2000-03649-1: 976 Ohms ±1% 0.1W, 1/10W Chip Resistor 0603 (1608 Metric) Automotive AEC-Q200 Thick Film; Part Number: CRCW0603976RFKEA; Manufacturer: Vishay Dale
R16 = CMP-2002-00257-1: 8.45 kOhms ±1% 0.063W, 1/16W Chip Resistor 0402 (1005 Metric) Automotive AEC-Q200 Thick Film; Part Number: CRCW04028K45FKED; Manufacturer: Vishay Dale
R17 = CMP-2002-08422-1: 26.1 kOhms ±1% 0.063W, 1/16W Chip Resistor 0402 (1005 Metric) Automotive AEC-Q200 Thick Film; Part Number: CRCW040226K1FKED; Manufacturer: Vishay Dale
R33 = CMP-26527-000118-1: RES 0.01 OHM 1% 1/2W 1206; Max Power Dissipation: 500mW; Temperature Coefficient: 100ppm/°C; Resistance: 10mR; RoHS Compliant: Yes; Construction: Rectangular; Resistor Type: Thick Film; Military Standard: Not; Lead Free: Lead Free; Size Code: 1206; Case/Package: 1206; Case Code (Metric): 3216; Radiation Hardening: No; Contact Plating: Tin; Series: CSR; Max Operating Temperature: 155°C; Power Rating: 500mW; Mount: Surface Mount; Number of Terminations: 2; Packaging: Tape and Reel; Length: 0.12inch; Min Operating Temperature: -55°C; Width: 0.061inch; Depth: 1.55mm; Case Code (Imperial): 1206; Height: 0.026inch; Tolerance: 1%
R34 = Resistor_10ohm: RES TF 1/10W 10 OHM 1% 0603; Manufacturer: Yageo; Manufacturer Part Number: RT0603DRE0710RL; Resistance: 10R; Tolerance: 0.5%; Temperature Coefficient: 50ppm/°C; Max Power Dissipation: 100mW; Voltage Rating (DC): 50V; Supplier 1: Mouser; Supplier Part Number 1: 603-RT0603DRE0710RL; RoHS: Yes; Category: Chip SMD Resistors; Stock 1: 9956; Pricing 1: 1=0.16000, 10=0.10500, 50=0.10500, 100=0.04100, 1000=0.02100, 10000=0.01300 (USD); Case/Package: 0603; Contact Plating: Tin,Matte; Case Code (Metric): 1608; Case Code (Imperial): 0603; Min Operating Temperature: -55°C; Max Operating Temperature: 155°C; Resistor Type: Thin Film; Package Quantity: 5000; Packaging: Tape and Reel; Number of Terminations: 2; Features: Moisture Resistant; Series: RT; Length: 0.063inch; Width: 0.031inch; Height: 0.022inch; Radiation Hardening: No; RoHS Compliant: Yes; Lead Free: Lead Free; ComponentLink1URL: https://datasheet.ciiva.com/8891/pyu-rt-1-to-0-05-rohs-l-4-8891368.pdf?src-supplier=Avnet; ComponentLink1Description: https://datasheet.ciiva.com/8891/pyu-rt-1-to-0-05-rohs-l-4-8891368.pdf?src-supplier=Avnet; ComponentLink2URL: https://datasheet.ciiva.com/2565/pyu-rt-1-to-0-05-rohs-l-5-2565943.pdf?src-supplier=Digi-Key; ComponentLink2Description: https://datasheet.ciiva.com/2565/pyu-rt-1-to-0-05-rohs-l-5-2565943.pdf?src-supplier=Digi-Key; Supplier 2: Digi-Key; Supplier Part Number 2: RMCF0603FT10R0TR-ND; Stock 2: 6764342; Pricing 2: 5000=0.00218 (USD); Mount: Surface Mount; Power Rating: 100mW; Construction: Rectangular; Depth: 0.8mm; Military Standard: Not; ComponentLink3URL: http://components.arrow.com/part/dataview/44988319S6756893N1174?src-supplier=Arrow+Electronics; ComponentLink3Description: http://components.arrow.com/part/dataview/44988319S6756893N1174?src-supplier=Arrow+Electronics; ComponentLink4URL: https://www.seielect.com/catalog/SEI-Packaging.pdf?src-supplier=Digi-Key; ComponentLink4Description: https://www.seielect.com/catalog/SEI-Packaging.pdf?src-supplier=Digi-Key; ComponentLink5URL: https://www.seielect.com/catalog/SEI-RMCF_RMCP.pdf?src-supplier=Avnet; ComponentLink5Description: https://www.seielect.com/catalog/SEI-RMCF_RMCP.pdf?src-supplier=Avnet; ComponentLink6URL: https://www.seielect.com/catalog/SEI-RMCF_RMCP.pdf?src-supplier=Avnet+Asia; ComponentLink6Description: https://www.seielect.com/catalog/SEI-RMCF_RMCP.pdf?src-supplier=Avnet+Asia; ComponentLink7URL: https://www.verical.com/server-webapp/html/getDatasheet?partID=372827&src-supplier=Verical; ComponentLink7Description: https://www.verical.com/server-webapp/html/getDatasheet?partID=372827&src-supplier=Verical
R37 = Resistor_3.74k: Res Thick Film 0603 3.74K Ohm 1% 1/10W ±100ppm/°C Molded SMD Paper T/R; Manufacturer: Yageo; Manufacturer Part Number: RC0603FR-073K74L; Resistance: 3.74kR; Power Rating: 100mW; Voltage Rating: 50V; Working Voltage: 75V; Supplier 1: Digi-Key; Supplier Part Number 1: 311-3.74KHRCT-ND; RoHS: Yes; Category: Chip SMD Resistors; Stock 1: 31077; Pricing 1: 1=0.10000, 10=0.02400, 100=0.00970, 1000=0.00436, 2500=0.00378 (USD); Case/Package: 0603; Contact Plating: Tin,Matte; Case Code (Imperial): 0603; Case Code (Metric): 1608; Min Operating Temperature: -55°C; Max Operating Temperature: 155°C; Tolerance: 1%; Temperature Coefficient: 100ppm/°C; Resistor Type: Thick Film; Packaging: Tape and Reel; Termination: SMD/SMT; Voltage Rating (DC): 50V; Number of Terminations: 2; Features: Moisture Resistant; Series: RC; Max Power Dissipation: 100mW; Construction: Rectangular; Technology: METAL OXIDE FILM; Length: 1.6mm; Depth: 0.8mm; Military Standard: Not; Lead Free: Lead Free; RoHS Compliant: Yes; ComponentLink1URL: https://datasheet.ciiva.com/8893/pyu-rc0603-51-rohs-l-4-8893463.pdf?src-supplier=Avnet; ComponentLink1Description: https://datasheet.ciiva.com/8893/pyu-rc0603-51-rohs-l-4-8893463.pdf?src-supplier=Avnet
U7 = LM3488MM/NOPB: Manufacturer Name: Texas Instruments; PackageReference: LM3488MM/NOPB; Manufacturer Part Number: LM3488MM/NOPB; Value: N/A
U8 = MOSFET: N沟道 VDS=30V VGS=+10V，-8V ID=14A P=2.7W; Manufacturer: Texas Instruments; Manufacturer Part Number: CSD17308Q3T; Max Power Dissipation: 2.7W; Element Configuration: Single; Drain to Source Voltage (Vdss): 30V; Continuous Drain Current (ID): 44A; Rds On Max: 10.3mR; Input Capacitance: 700pF; Threshold Voltage: 1.3V; Supplier 1: Digi-Key; Supplier Part Number 1: 296-44075-6-ND; RoHS: Yes; Category: Integrated Circuits (ICs); Pricing 1: 1=1.06000, 10=0.94800, 100=0.73880 (USD); Mount: Surface Mount; Number of Pins: 8; Min Operating Temperature: -55°C; Max Operating Temperature: 150°C; Packaging: Tape and Reel; Lead Free: Contains Lead; REACH SVHC: No SVHC; RoHS Compliant: Yes; ComponentLink1URL: http://www.ti.com/lit/pdf/slvt145?src-supplier=Digi-Key; ComponentLink1Description: http://www.ti.com/lit/pdf/slvt145?src-supplier=Digi-Key; ComponentLink2URL: http://www.ti.com/lit/ds/symlink/csd17308q3.pdf?src-supplier=Digi-Key; ComponentLink2Description: http://www.ti.com/lit/ds/symlink/csd17308q3.pdf?src-supplier=Digi-Key; ComponentLink3URL: http://www.ti.com/lit/gpn/csd17308q3?src-supplier=Mouser; ComponentLink3Description: http://www.ti.com/lit/gpn/csd17308q3?src-supplier=Mouser; ComponentLink4URL: http://www.ti.com/general/docs/lit/getliterature.tsp?genericPartNumber=CSD17308Q3&&fileType=pdf&src-supplier=Element14; ComponentLink4Description: http://www.ti.com/general/docs/lit/getliterature.tsp?genericPartNumber=CSD17308Q3&&fileType=pdf&src-supplier=Element14